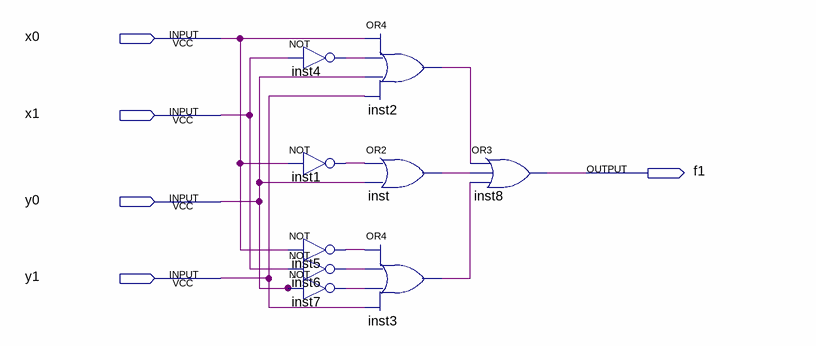
[diagram p0: schematic sheet]
// Quartus schematic dual1.bdf as structural Verilog: 9 symbols, 5 pins
module dual1 (
  input  x0,
  input  x1,
  input  y0,
  input  y1,
  output f1
);

  wire inst1_out, inst2_out, inst3_out, inst4_out, inst5_out, inst6_out, inst7_out, inst_out;

  not inst4 (inst4_out, x1);
  not inst1 (inst1_out, x0);
  not inst5 (inst5_out, x0);
  not inst6 (inst6_out, x1);
  not inst7 (inst7_out, y0);
  or inst2 (inst2_out, x0, inst4_out, y0, y1);
  or inst (inst_out, inst1_out, y0);
  or inst3 (inst3_out, inst5_out, inst6_out, inst7_out, y1);
  or inst8 (f1, inst2_out, inst_out, inst3_out);
endmodule
